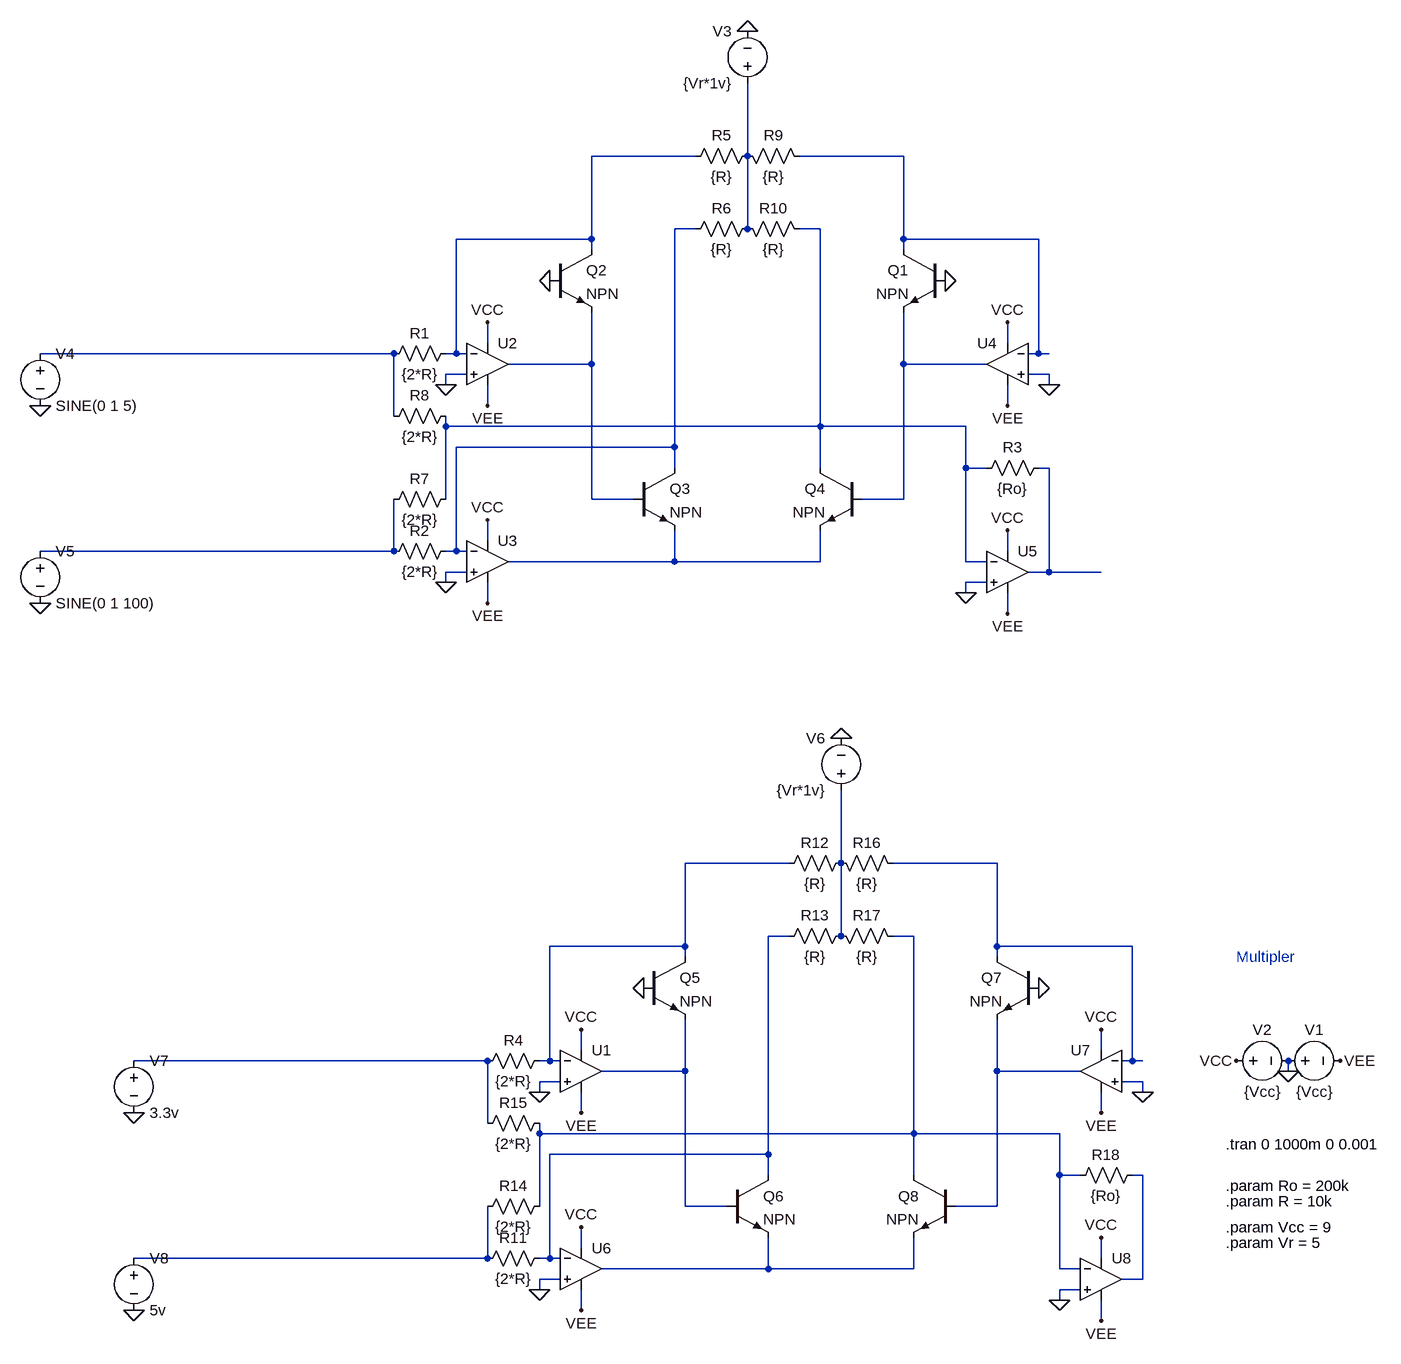
[diagram p0: schematic multiplier.asc]
multiplier.asc, the LTspice schematic file:
Version 4.1
SHEET 1 4964 1848
WIRE 1040 -32 880 -32
WIRE 1120 -32 1120 -144
WIRE 1360 -32 1200 -32
WIRE 1040 80 1008 80
WIRE 1120 80 1120 -32
WIRE 1232 80 1200 80
WIRE 880 96 880 -32
WIRE 880 96 672 96
WIRE 1360 96 1360 -32
WIRE 1568 96 1360 96
WIRE 880 112 880 96
WIRE 1360 112 1360 96
WIRE 720 256 720 224
WIRE 1520 256 1520 224
WIRE 576 272 32 272
WIRE 672 272 672 96
WIRE 672 272 656 272
WIRE 688 272 672 272
WIRE 1568 272 1568 96
WIRE 1568 272 1552 272
WIRE 1584 272 1568 272
WIRE 880 288 880 208
WIRE 880 288 752 288
WIRE 1360 288 1360 208
WIRE 1488 288 1360 288
WIRE 688 304 656 304
WIRE 1584 304 1552 304
WIRE 656 320 656 304
WIRE 1584 320 1584 304
WIRE 720 352 720 320
WIRE 1520 352 1520 320
WIRE 576 368 576 272
WIRE 656 384 656 368
WIRE 1232 384 1232 80
WIRE 1232 384 656 384
WIRE 1456 384 1232 384
WIRE 1008 416 1008 80
WIRE 1008 416 672 416
WIRE 1008 448 1008 416
WIRE 1232 448 1232 384
WIRE 1456 448 1456 384
WIRE 1488 448 1456 448
WIRE 1584 448 1568 448
WIRE 656 496 656 384
WIRE 880 496 880 288
WIRE 944 496 880 496
WIRE 1360 496 1360 288
WIRE 1360 496 1296 496
WIRE 720 560 720 528
WIRE 576 576 576 496
WIRE 576 576 32 576
WIRE 672 576 672 416
WIRE 672 576 656 576
WIRE 688 576 672 576
WIRE 1520 576 1520 544
WIRE 1008 592 1008 544
WIRE 1008 592 752 592
WIRE 1232 592 1232 544
WIRE 1232 592 1008 592
WIRE 1456 592 1456 448
WIRE 1488 592 1456 592
WIRE 688 608 656 608
WIRE 1584 608 1584 448
WIRE 1584 608 1552 608
WIRE 1664 608 1584 608
WIRE 656 624 656 608
WIRE 1488 624 1456 624
WIRE 1456 640 1456 624
WIRE 720 656 720 624
WIRE 1520 672 1520 640
WIRE 1184 1056 1024 1056
WIRE 1264 1056 1264 944
WIRE 1504 1056 1344 1056
WIRE 1184 1168 1152 1168
WIRE 1264 1168 1264 1056
WIRE 1376 1168 1344 1168
WIRE 1024 1184 1024 1056
WIRE 1024 1184 816 1184
WIRE 1504 1184 1504 1056
WIRE 1712 1184 1504 1184
WIRE 1024 1200 1024 1184
WIRE 1504 1200 1504 1184
WIRE 864 1344 864 1312
WIRE 1664 1344 1664 1312
WIRE 720 1360 176 1360
WIRE 816 1360 816 1184
WIRE 816 1360 800 1360
WIRE 832 1360 816 1360
WIRE 1712 1360 1712 1184
WIRE 1712 1360 1696 1360
WIRE 1728 1360 1712 1360
WIRE 1024 1376 1024 1296
WIRE 1024 1376 896 1376
WIRE 1504 1376 1504 1296
WIRE 1632 1376 1504 1376
WIRE 1952 1376 1952 1360
WIRE 832 1392 800 1392
WIRE 1728 1392 1696 1392
WIRE 800 1408 800 1392
WIRE 1728 1408 1728 1392
WIRE 864 1440 864 1408
WIRE 1664 1440 1664 1408
WIRE 720 1456 720 1360
WIRE 800 1472 800 1456
WIRE 1376 1472 1376 1168
WIRE 1376 1472 800 1472
WIRE 1600 1472 1376 1472
WIRE 1152 1504 1152 1168
WIRE 1152 1504 816 1504
WIRE 1152 1536 1152 1504
WIRE 1376 1536 1376 1472
WIRE 1600 1536 1600 1472
WIRE 1632 1536 1600 1536
WIRE 1728 1536 1712 1536
WIRE 800 1584 800 1472
WIRE 1024 1584 1024 1376
WIRE 1088 1584 1024 1584
WIRE 1504 1584 1504 1376
WIRE 1504 1584 1440 1584
WIRE 864 1648 864 1616
WIRE 720 1664 720 1584
WIRE 720 1664 176 1664
WIRE 816 1664 816 1504
WIRE 816 1664 800 1664
WIRE 832 1664 816 1664
WIRE 1664 1664 1664 1632
WIRE 1152 1680 1152 1632
WIRE 1152 1680 896 1680
WIRE 1376 1680 1376 1632
WIRE 1376 1680 1152 1680
WIRE 1600 1680 1600 1536
WIRE 1632 1680 1600 1680
WIRE 832 1696 800 1696
WIRE 1728 1696 1728 1536
WIRE 1728 1696 1696 1696
WIRE 800 1712 800 1696
WIRE 1632 1712 1600 1712
WIRE 1600 1728 1600 1712
WIRE 864 1744 864 1712
WIRE 1664 1760 1664 1728
FLAG 1952 1376 0
FLAG 1872 1360 VCC
FLAG 2032 1360 VEE
FLAG 720 224 VCC
FLAG 720 352 VEE
FLAG 656 320 0
FLAG 720 528 VCC
FLAG 720 656 VEE
FLAG 656 624 0
FLAG 816 160 0
FLAG 1520 224 VCC
FLAG 1520 352 VEE
FLAG 1584 320 0
FLAG 1520 544 VCC
FLAG 1520 672 VEE
FLAG 1456 640 0
FLAG 1424 160 0
FLAG 1120 -224 0
FLAG 32 352 0
FLAG 32 656 0
FLAG 864 1312 VCC
FLAG 864 1440 VEE
FLAG 800 1408 0
FLAG 864 1616 VCC
FLAG 864 1744 VEE
FLAG 800 1712 0
FLAG 960 1248 0
FLAG 1664 1312 VCC
FLAG 1664 1440 VEE
FLAG 1728 1408 0
FLAG 1664 1632 VCC
FLAG 1664 1760 VEE
FLAG 1600 1728 0
FLAG 1568 1248 0
FLAG 1264 864 0
FLAG 176 1440 0
FLAG 176 1744 0
SYMBOL voltage 1936 1360 R270
WINDOW 0 32 56 VTop 2
WINDOW 3 -32 56 VBottom 2
SYMATTR InstName V1
SYMATTR Value {Vcc}
SYMBOL voltage 1856 1360 R270
WINDOW 0 32 56 VTop 2
WINDOW 3 -32 56 VBottom 2
SYMATTR InstName V2
SYMATTR Value {Vcc}
SYMBOL OpAmps\\UniversalOpAmp2 720 288 R0
SYMATTR InstName U2
SYMATTR Value2 Avol=1Meg GBW=1Meg Slew=10Meg
SYMBOL res 672 256 R90
WINDOW 0 0 56 VBottom 2
WINDOW 3 32 56 VTop 2
SYMATTR InstName R1
SYMATTR Value {2*R}
SYMBOL OpAmps\\UniversalOpAmp2 720 592 R0
SYMATTR InstName U3
SYMATTR Value2 Avol=1Meg GBW=1Meg Slew=10Meg
SYMBOL res 672 560 R90
WINDOW 0 0 56 VBottom 2
WINDOW 3 32 56 VTop 2
SYMATTR InstName R2
SYMATTR Value {2*R}
SYMBOL npn 816 112 R0
SYMATTR InstName Q2
SYMBOL npn 944 448 R0
SYMATTR InstName Q3
SYMBOL res 1136 -48 R90
WINDOW 0 0 56 VBottom 2
WINDOW 3 32 56 VTop 2
SYMATTR InstName R5
SYMATTR Value {R}
SYMBOL res 1136 64 R90
WINDOW 0 0 56 VBottom 2
WINDOW 3 32 56 VTop 2
SYMATTR InstName R6
SYMATTR Value {R}
SYMBOL res 672 480 R90
WINDOW 0 0 56 VBottom 2
WINDOW 3 32 56 VTop 2
SYMATTR InstName R7
SYMATTR Value {2*R}
SYMBOL res 672 352 R90
WINDOW 0 0 56 VBottom 2
WINDOW 3 32 56 VTop 2
SYMATTR InstName R8
SYMATTR Value {2*R}
SYMBOL OpAmps\\UniversalOpAmp2 1520 288 M0
SYMATTR InstName U4
SYMATTR Value2 Avol=1Meg GBW=1Meg Slew=10Meg
SYMBOL OpAmps\\UniversalOpAmp2 1520 608 R0
SYMATTR InstName U5
SYMATTR Value2 Avol=1Meg GBW=1Meg Slew=10Meg
SYMBOL npn 1424 112 M0
SYMATTR InstName Q1
SYMBOL npn 1296 448 M0
SYMATTR InstName Q4
SYMBOL res 1104 -48 M90
WINDOW 0 0 56 VBottom 2
WINDOW 3 32 56 VTop 2
SYMATTR InstName R9
SYMATTR Value {R}
SYMBOL res 1104 64 M90
WINDOW 0 0 56 VBottom 2
WINDOW 3 32 56 VTop 2
SYMATTR InstName R10
SYMATTR Value {R}
SYMBOL voltage 1120 -128 R180
WINDOW 0 24 96 Left 2
WINDOW 3 24 16 Left 2
SYMATTR InstName V3
SYMATTR Value {Vr*1v}
SYMBOL res 1584 432 R90
WINDOW 0 0 56 VBottom 2
WINDOW 3 32 56 VTop 2
SYMATTR InstName R3
SYMATTR Value {Ro}
SYMBOL voltage 32 256 R0
WINDOW 123 0 0 Left 0
WINDOW 39 0 0 Left 0
SYMATTR InstName V4
SYMATTR Value SINE(0 1 5)
SYMBOL voltage 32 560 R0
SYMATTR InstName V5
SYMATTR Value SINE(0 1 100)
SYMBOL OpAmps\\UniversalOpAmp2 864 1376 R0
SYMATTR InstName U1
SYMATTR Value2 Avol=1Meg GBW=1Meg Slew=10Meg
SYMBOL res 816 1344 R90
WINDOW 0 0 56 VBottom 2
WINDOW 3 32 56 VTop 2
SYMATTR InstName R4
SYMATTR Value {2*R}
SYMBOL OpAmps\\UniversalOpAmp2 864 1680 R0
SYMATTR InstName U6
SYMATTR Value2 Avol=1Meg GBW=1Meg Slew=10Meg
SYMBOL res 816 1648 R90
WINDOW 0 0 56 VBottom 2
WINDOW 3 32 56 VTop 2
SYMATTR InstName R11
SYMATTR Value {2*R}
SYMBOL npn 960 1200 R0
SYMATTR InstName Q5
SYMBOL npn 1088 1536 R0
SYMATTR InstName Q6
SYMBOL res 1280 1040 R90
WINDOW 0 0 56 VBottom 2
WINDOW 3 32 56 VTop 2
SYMATTR InstName R12
SYMATTR Value {R}
SYMBOL res 1280 1152 R90
WINDOW 0 0 56 VBottom 2
WINDOW 3 32 56 VTop 2
SYMATTR InstName R13
SYMATTR Value {R}
SYMBOL res 816 1568 R90
WINDOW 0 0 56 VBottom 2
WINDOW 3 32 56 VTop 2
SYMATTR InstName R14
SYMATTR Value {2*R}
SYMBOL res 816 1440 R90
WINDOW 0 0 56 VBottom 2
WINDOW 3 32 56 VTop 2
SYMATTR InstName R15
SYMATTR Value {2*R}
SYMBOL OpAmps\\UniversalOpAmp2 1664 1376 M0
SYMATTR InstName U7
SYMATTR Value2 Avol=1Meg GBW=1Meg Slew=10Meg
SYMBOL OpAmps\\UniversalOpAmp2 1664 1696 R0
SYMATTR InstName U8
SYMATTR Value2 Avol=1Meg GBW=1Meg Slew=10Meg
SYMBOL npn 1568 1200 M0
SYMATTR InstName Q7
SYMBOL npn 1440 1536 M0
SYMATTR InstName Q8
SYMBOL res 1248 1040 M90
WINDOW 0 0 56 VBottom 2
WINDOW 3 32 56 VTop 2
SYMATTR InstName R16
SYMATTR Value {R}
SYMBOL res 1248 1152 M90
WINDOW 0 0 56 VBottom 2
WINDOW 3 32 56 VTop 2
SYMATTR InstName R17
SYMATTR Value {R}
SYMBOL voltage 1264 960 R180
WINDOW 0 24 96 Left 2
WINDOW 3 24 16 Left 2
SYMATTR InstName V6
SYMATTR Value {Vr*1v}
SYMBOL res 1728 1520 R90
WINDOW 0 0 56 VBottom 2
WINDOW 3 32 56 VTop 2
SYMATTR InstName R18
SYMATTR Value {Ro}
SYMBOL voltage 176 1344 R0
WINDOW 123 0 0 Left 0
WINDOW 39 0 0 Left 0
SYMATTR InstName V7
SYMATTR Value 3.3v
SYMBOL voltage 176 1648 R0
SYMATTR InstName V8
SYMATTR Value 5v
TEXT 1856 1552 Left 2 !.param Ro = 200k
TEXT 1856 1616 Left 2 !.param Vcc = 9
TEXT 1856 1488 Left 2 !.tran 0 1000m 0 0.001
TEXT 1856 1576 Left 2 !.param R = 10k
TEXT 1872 1200 Left 2 ;Multipler
TEXT 1856 1640 Left 2 !.param Vr = 5

The netlist it stands for:
* multiplier.asc
V1 0 VEE {Vcc}
V2 VCC 0 {Vcc}
X§U2 0 N001 VCC VEE N007 level2 Avol=1Meg GBW=1Meg Slew=10Meg Ilimit=25m Rail=0 Vos=0 En=0 Enk=0 In=0 Ink=0 Rin=500Meg  ; pins In+ In- V+ V- OUT
R1 N001 N006 {2*R}
X§U3 0 N004 VCC VEE N011 level2 Avol=1Meg GBW=1Meg Slew=10Meg Ilimit=25m Rail=0 Vos=0 En=0 Enk=0 In=0 Ink=0 Rin=500Meg  ; pins In+ In- V+ V- OUT
R2 N004 N010 {2*R}
Q2 N001 0 N007 0 NPN
Q3 N004 N007 N011 0 NPN
R5 N002 N001 {R}
R6 N002 N004 {R}
R7 N005 N010 {2*R}
R8 N005 N006 {2*R}
X§U4 0 N003 VCC VEE N008 level2 Avol=1Meg GBW=1Meg Slew=10Meg Ilimit=25m Rail=0 Vos=0 En=0 Enk=0 In=0 Ink=0 Rin=500Meg  ; pins In+ In- V+ V- OUT
X§U5 0 N005 VCC VEE N009 level2 Avol=1Meg GBW=1Meg Slew=10Meg Ilimit=25m Rail=0 Vos=0 En=0 Enk=0 In=0 Ink=0 Rin=500Meg  ; pins In+ In- V+ V- OUT
Q1 N003 0 N008 0 NPN
Q4 N005 N008 N011 0 NPN
R9 N002 N003 {R}
R10 N002 N005 {R}
V3 N002 0 {Vr*1v}
R3 N009 N005 {Ro}
V4 N006 0 SINE(0 1 5)
V5 N010 0 SINE(0 1 100)
X§U1 0 N012 VCC VEE N018 level2 Avol=1Meg GBW=1Meg Slew=10Meg Ilimit=25m Rail=0 Vos=0 En=0 Enk=0 In=0 Ink=0 Rin=500Meg  ; pins In+ In- V+ V- OUT
R4 N012 N017 {2*R}
X§U6 0 N015 VCC VEE N022 level2 Avol=1Meg GBW=1Meg Slew=10Meg Ilimit=25m Rail=0 Vos=0 En=0 Enk=0 In=0 Ink=0 Rin=500Meg  ; pins In+ In- V+ V- OUT
R11 N015 N021 {2*R}
Q5 N012 0 N018 0 NPN
Q6 N015 N018 N022 0 NPN
R12 N013 N012 {R}
R13 N013 N015 {R}
R14 N016 N021 {2*R}
R15 N016 N017 {2*R}
X§U7 0 N014 VCC VEE N019 level2 Avol=1Meg GBW=1Meg Slew=10Meg Ilimit=25m Rail=0 Vos=0 En=0 Enk=0 In=0 Ink=0 Rin=500Meg  ; pins In+ In- V+ V- OUT
X§U8 0 N016 VCC VEE N020 level2 Avol=1Meg GBW=1Meg Slew=10Meg Ilimit=25m Rail=0 Vos=0 En=0 Enk=0 In=0 Ink=0 Rin=500Meg  ; pins In+ In- V+ V- OUT
Q7 N014 0 N019 0 NPN
Q8 N016 N019 N022 0 NPN
R16 N013 N014 {R}
R17 N013 N016 {R}
V6 N013 0 {Vr*1v}
R18 N020 N016 {Ro}
V7 N017 0 3.3v
V8 N021 0 5v
.model NPN NPN
.model PNP PNP
.lib standard.bjt
.param Ro = 200k
.param Vcc = 9
.tran 0 1000m 0 0.001
.param R = 10k
* Multipler
.param Vr = 5
.lib UniversalOpAmp2.lib
.backanno
.end